# Altium schematic sheet pca10112_sheet3_pin_map.SchDoc: PCA10112 - Pin Map
size A3; Organization: Nordic Semiconductor; DocumentNumber: 3; Revision: 1.0.0; SheetNumber: 3; SheetTotal: 8; CompanyName: Nordic Semiconductor; ProjectName: pca10112.PrjPCB
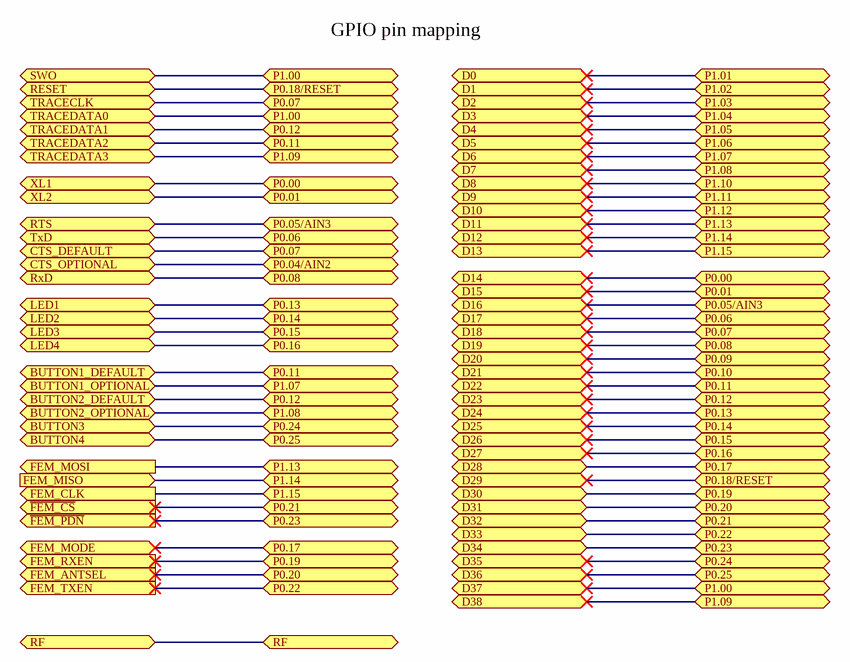
[diagram p0: pca10112_sheet3_pin_map.SchDoc]

## Ports
BUTTON1_DEFAULT (bidir), BUTTON1_OPTIONAL (bidir), BUTTON2_DEFAULT (bidir), BUTTON2_OPTIONAL (bidir), BUTTON3 (bidir), BUTTON4 (bidir), CTS_DEFAULT (bidir), CTS_OPTIONAL (bidir), D0 (bidir), D1 (bidir), D2 (bidir), D3 (bidir), D4 (bidir), D5 (bidir), D6 (bidir), D7 (bidir), D8 (bidir), D9 (bidir), D10 (bidir), D11 (bidir), D12 (bidir), D13 (bidir), D14 (bidir), D15 (bidir), D16 (bidir), D17 (bidir), D18 (bidir), D19 (bidir), D20 (bidir), D21 (bidir), D22 (bidir), D23 (bidir), D24 (bidir), D25 (bidir), D26 (bidir), D27 (bidir), D28 (bidir), D29 (bidir), D30 (bidir), D31 (bidir), D32 (bidir), D33 (bidir), D34 (bidir), D35 (bidir), D36 (bidir), D37 (bidir), D38 (bidir), FEM_ANTSEL (out), FEM_CLK (out), FEM_MISO (in), FEM_MODE (bidir), FEM_MOSI (out), FEM_RXEN (out), FEM_TXEN (out), LED1 (bidir), LED2 (bidir), LED3 (bidir), LED4 (bidir), P0.00 (bidir), P0.01 (bidir), P0.04/AIN2 (bidir), P0.05/AIN3 (bidir), P0.06 (bidir), P0.07 (bidir), P0.08 (bidir), P0.09 (bidir), P0.10 (bidir), P0.11 (bidir), P0.12 (bidir), P0.13 (bidir), P0.14 (bidir), P0.15 (bidir), P0.16 (bidir), P0.17 (bidir), P0.18/RESET (bidir), P0.19 (bidir), P0.20 (bidir), P0.21 (bidir), P0.22 (bidir), P0.23 (bidir), P0.24 (bidir), P0.25 (bidir), P1.00 (bidir), P1.01 (bidir), P1.02 (bidir), P1.03 (bidir), P1.04 (bidir), P1.05 (bidir), P1.06 (bidir), P1.07 (bidir), P1.08 (bidir), P1.09 (bidir), P1.10 (bidir), P1.11 (bidir), P1.12 (bidir), P1.13 (bidir), P1.14 (bidir), P1.15 (bidir), RESET (bidir), RF (bidir), RTS (bidir), RxD (bidir), SWO (bidir), TRACECLK (bidir), TRACEDATA0 (bidir), TRACEDATA1 (bidir), TRACEDATA2 (bidir), TRACEDATA3 (bidir), TxD (bidir), XL1 (bidir), XL2 (bidir), ~{FEM_CS} (out), ~{FEM_PDN} (out)

## Nets
BUTTON1_DEFAULT: port TRACEDATA2, port P0.11, port BUTTON1_DEFAULT, port D22
BUTTON1_OPTIONAL: port P1.07, port BUTTON1_OPTIONAL, port D6
BUTTON2_DEFAULT: port TRACEDATA1, port P0.12, port BUTTON2_DEFAULT, port D23
BUTTON2_OPTIONAL: port P1.08, port BUTTON2_OPTIONAL, port D7
BUTTON3: port P0.24, port BUTTON3, port D35
BUTTON4: port P0.25, port BUTTON4, port D36
CTS_DEFAULT: port P0.07, port TRACECLK, port CTS_DEFAULT, port D18
CTS_OPTIONAL: port P0.04/AIN2, port CTS_OPTIONAL
D0: port P1.01, port D0
D1: port P1.02, port D1
D2: port P1.03, port D2
D3: port P1.04, port D3
D4: port P1.05, port D4
D5: port P1.06, port D5
D8: port P1.10, port D8
D9: port P1.11, port D9
D10: port P1.12, port D10
D11: port P1.13, port FEM_MOSI, port D11
D12: port P1.14, port FEM_MISO, port D12
D13: port P1.15, port FEM_CLK, port D13
D14: port P0.00, port XL1, port D14
D15: port P0.01, port XL2, port D15
D16: port RTS, port D16, port P0.05/AIN3
D17: port TxD, port P0.06, port D17
D19: port RxD, port P0.08, port D19
D20: port D20, port P0.09
D21: port D21, port P0.10
D24: port P0.13, port LED1, port D24
D25: port P0.14, port LED2, port D25
D26: port P0.15, port LED3, port D26
D27: port P0.16, port LED4, port D27
D28: port P0.17, port FEM_MODE, port D28
D29: port RESET, port P0.18/RESET, port D29
D30: port P0.19, port D30, port FEM_RXEN
D31: port P0.20, port D31, port FEM_ANTSEL
D32: port P0.21, port ~{FEM_CS}, port D32
D33: port P0.22, port D33, port FEM_TXEN
D34: port P0.23, port ~{FEM_PDN}, port D34
D37: port TRACEDATA0, port SWO, port P1.00, port D37
D38: port TRACEDATA3, port P1.09, port D38

## Notes on the sheet
- GPIO pin mapping
- Size
- Date:
- A3
- Project Number
- Sheet         of
- Revision
- File:
- Drawn By: